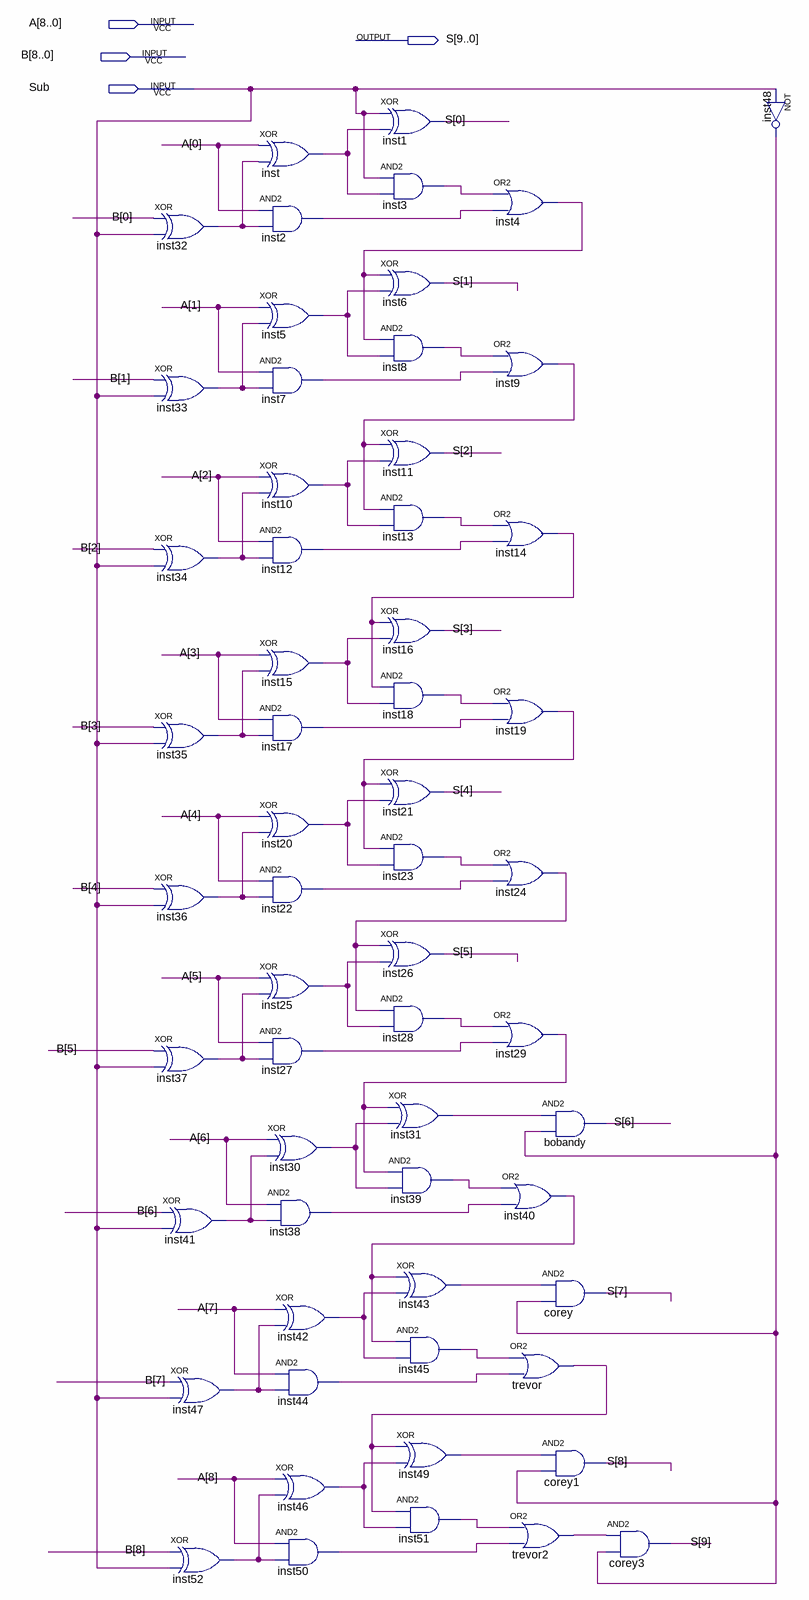
[diagram p0: schematic sheet]
// Quartus schematic g07_adder.bdf as structural Verilog: 59 symbols, 4 pins
module g07_adder (
  input  [8:0] A,
  input  [8:0] B,
  input  Sub,
  output [9:0] S
);

  wire inst2_out, inst3_out, inst4_out, inst5_out, inst7_out, inst8_out, inst9_out, inst10_out, inst12_out,
       inst13_out, inst14_out, inst15_out, inst17_out, inst18_out, inst19_out, inst20_out, inst22_out,
       inst23_out, inst24_out, inst25_out, inst27_out, inst28_out, inst29_out, inst30_out, inst31_out,
       inst32_out, inst33_out, inst34_out, inst35_out, inst36_out, inst37_out, inst38_out, inst39_out,
       inst40_out, inst41_out, inst42_out, inst43_out, inst44_out, inst45_out, inst46_out, inst47_out,
       inst48_out, inst49_out, inst50_out, inst51_out, inst52_out, inst_out, trevor2_out, trevor_out;

  xor inst32 (inst32_out, B[0], Sub);
  xor inst33 (inst33_out, B[1], Sub);
  xor inst34 (inst34_out, B[2], Sub);
  xor inst35 (inst35_out, B[3], Sub);
  xor inst36 (inst36_out, B[4], Sub);
  xor inst37 (inst37_out, B[5], Sub);
  xor inst41 (inst41_out, B[6], Sub);
  xor inst47 (inst47_out, B[7], Sub);
  xor inst52 (inst52_out, B[8], Sub);
  xor inst (inst_out, A[0], inst32_out);
  and inst2 (inst2_out, A[0], inst32_out);
  xor inst5 (inst5_out, A[1], inst33_out);
  and inst7 (inst7_out, A[1], inst33_out);
  xor inst10 (inst10_out, A[2], inst34_out);
  and inst12 (inst12_out, A[2], inst34_out);
  xor inst15 (inst15_out, A[3], inst35_out);
  and inst17 (inst17_out, A[3], inst35_out);
  xor inst20 (inst20_out, A[4], inst36_out);
  and inst22 (inst22_out, A[4], inst36_out);
  xor inst25 (inst25_out, A[5], inst37_out);
  and inst27 (inst27_out, A[5], inst37_out);
  xor inst30 (inst30_out, A[6], inst41_out);
  and inst38 (inst38_out, A[6], inst41_out);
  xor inst42 (inst42_out, A[7], inst47_out);
  and inst44 (inst44_out, A[7], inst47_out);
  xor inst46 (inst46_out, A[8], inst52_out);
  and inst50 (inst50_out, A[8], inst52_out);
  xor inst1 (S[0], Sub, inst_out);
  and inst3 (inst3_out, Sub, inst_out);
  xor inst6 (S[1], inst4_out, inst5_out);
  and inst8 (inst8_out, inst4_out, inst5_out);
  xor inst11 (S[2], inst9_out, inst10_out);
  and inst13 (inst13_out, inst9_out, inst10_out);
  xor inst16 (S[3], inst14_out, inst15_out);
  and inst18 (inst18_out, inst14_out, inst15_out);
  xor inst21 (S[4], inst19_out, inst20_out);
  and inst23 (inst23_out, inst19_out, inst20_out);
  xor inst26 (S[5], inst24_out, inst25_out);
  and inst28 (inst28_out, inst24_out, inst25_out);
  xor inst31 (inst31_out, inst29_out, inst30_out);
  and inst39 (inst39_out, inst29_out, inst30_out);
  xor inst43 (inst43_out, inst40_out, inst42_out);
  and inst45 (inst45_out, inst40_out, inst42_out);
  xor inst49 (inst49_out, trevor_out, inst46_out);
  and inst51 (inst51_out, trevor_out, inst46_out);
  or inst4 (inst4_out, inst3_out, inst2_out);
  or inst9 (inst9_out, inst8_out, inst7_out);
  or inst14 (inst14_out, inst13_out, inst12_out);
  or inst19 (inst19_out, inst18_out, inst17_out);
  or inst24 (inst24_out, inst23_out, inst22_out);
  or inst29 (inst29_out, inst28_out, inst27_out);
  and bobandy (S[6], inst31_out, inst48_out);
  or inst40 (inst40_out, inst39_out, inst38_out);
  and corey (S[7], inst43_out, inst48_out);
  or trevor (trevor_out, inst45_out, inst44_out);
  and corey1 (S[8], inst49_out, inst48_out);
  or trevor2 (trevor2_out, inst51_out, inst50_out);
  and corey3 (S[9], trevor2_out, inst48_out);
  not inst48 (inst48_out, Sub);
endmodule
